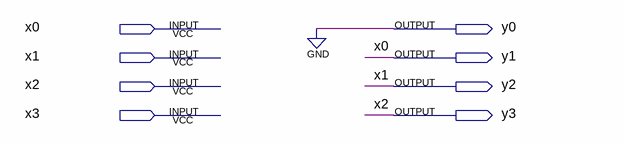
[diagram p0: schematic sheet]
// Quartus schematic bit_shift_left.bdf as structural Verilog: 0 symbols, 8 pins
module bit_shift_left (
  input  x0,
  input  x1,
  input  x2,
  input  x3,
  output y0,
  output y1,
  output y2,
  output y3
);


  assign y0 = 1'b0;
  assign y1 = x0;
  assign y2 = x1;
  assign y3 = x2;
endmodule
